# Altium schematic sheet Brightness_Sensor_Schematic.SchDoc
size A4; DocumentNumber: 5; SheetNumber: 5; SheetTotal: 5
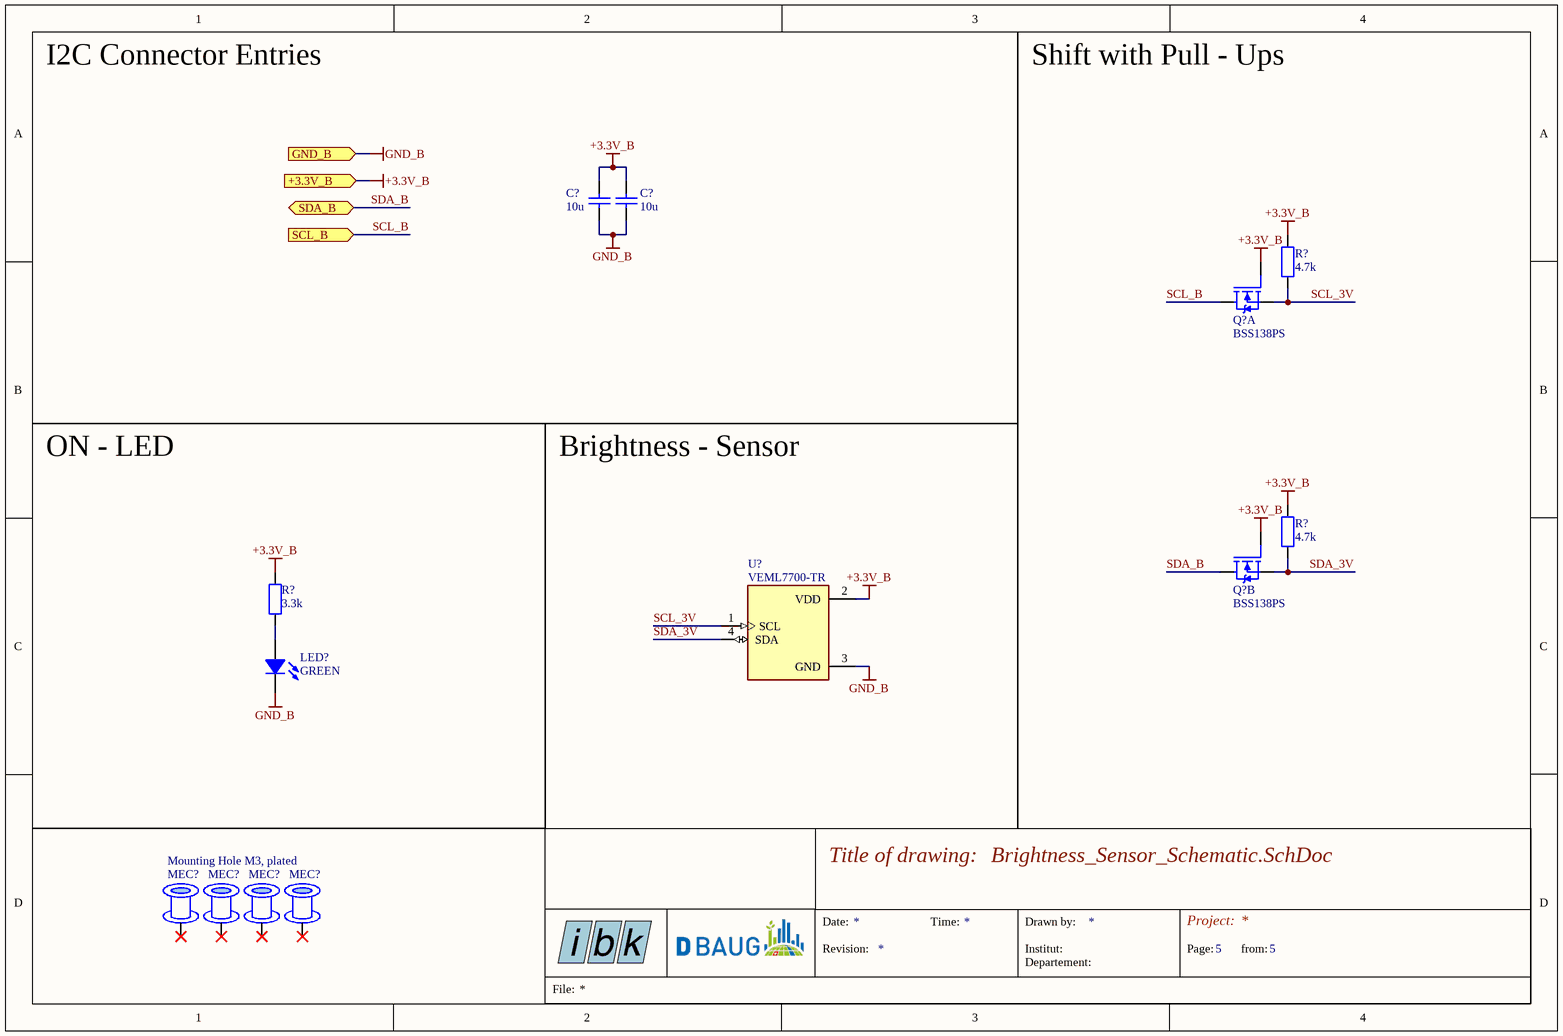
[diagram p0: Brightness_Sensor_Schematic.SchDoc]

## Parts
(Parts that share a designator on the sheet are numbered #1, #2 ... from top to bottom, then left to right.)
C?#1  10u  [0603_CAPACITOR]
C?#2  10u  [0603_CAPACITOR]
LED?  GREEN  [LED_0603, GREEN]
MEC?#1  Mounting Hole M3, plated  [Mounting Hole M3, plated]
MEC?#2  Mounting Hole M3, plated  [Mounting Hole M3, plated]  (value not drawn)
MEC?#3  Mounting Hole M3, plated  [Mounting Hole M3, plated]  (value not drawn)
MEC?#4  Mounting Hole M3, plated  [Mounting Hole M3, plated]  (value not drawn)
Q?#1  BSS138PS  [Dual_N_Channel_MOS_FET]  (part A of 2)
Q?#2  BSS138PS  [Dual_N_Channel_MOS_FET]  (part B of 2)
R?#1  4.7k  [0603_Resistor]
R?#2  4.7k  [0603_Resistor]
R?#3  3.3k  [0603_Resistor]
U?  VEML7700-TR  [Brightness_Sensor]

## Ports
+3.3V_B (in), GND_B (in), SCL_B (in), SDA_B (bidir)

## Nets
+3.3V_B: C?#1.2 C?#2.2 Q?#1.2(G) Q?#2.2(G) R?#1.2 R?#2.2 R?#3.2 U?.2(VDD) ; port +3.3V_B
GND_B: C?#1.1 C?#2.1 LED?.K U?.3(GND) ; port GND_B
SCL_3V: Q?#1.1(S) R?#1.1 U?.1(SCL)
SCL_B: Q?#1.6(D) ; port SCL_B
SDA_3V: Q?#2.1(S) R?#2.1 U?.4(SDA)
SDA_B: Q?#2.6(D) ; port SDA_B
NetLED?_A: LED?.A R?#3.1

Not connected (* = marked no-connect by the designer): MEC?#1 1*; MEC?#2 1*; MEC?#3 1*; MEC?#4 1*

## Notes on the sheet
- I2C Connector Entries
- Shift with Pull - Ups
- ON - LED
- Brightness - Sensor
- Date:
- Title of drawing:
- Time:
- Drawn by:
- Project:
- Revision:
- Institut:
- Departement:
- Page:
- from:
- File:

## Library data of the parts
C?#1 C?#2 = Capacitor: 0603
LED? = LED_0603, GREEN: LED 0603, Green, 3.2 V, 20 mA, 430 mcd
MEC?#1-MEC?#4 = Mounting Hole M3, plated: Mounting Hole for M3 Screw, plated to connect signal
Q?#1 Q?#2 = Dual_N_Channel_MOS_FET: Mosfet Array 60V 300mA (Ta) 350mW (Ta) Surface Mount SOT-23-6.; ComponentLink1Description: Supplier; ComponentLink1URL: https://www.digikey.ch/en/products/detail/nexperia-usa-inc/2N7002PS-115/2296325?s=N4IgTCBcDaIKwDYAcBaOBOJAWFBGFAcgCIgC6AvkA
R?#1-R?#3 = Resistor: 0603
U? = Brightness_Sensor: SENSOR OPT 545NMAMB 4 SMD J LEAD.; ComponentLink1Description: Supplier; ComponentLink1URL: https://www.digikey.ch/en/products/detail/vishay-semiconductor-opto-division/VEML7700-TR/5820243